# EAGLE design OnboardGlov2 (EAGLE 5.11)
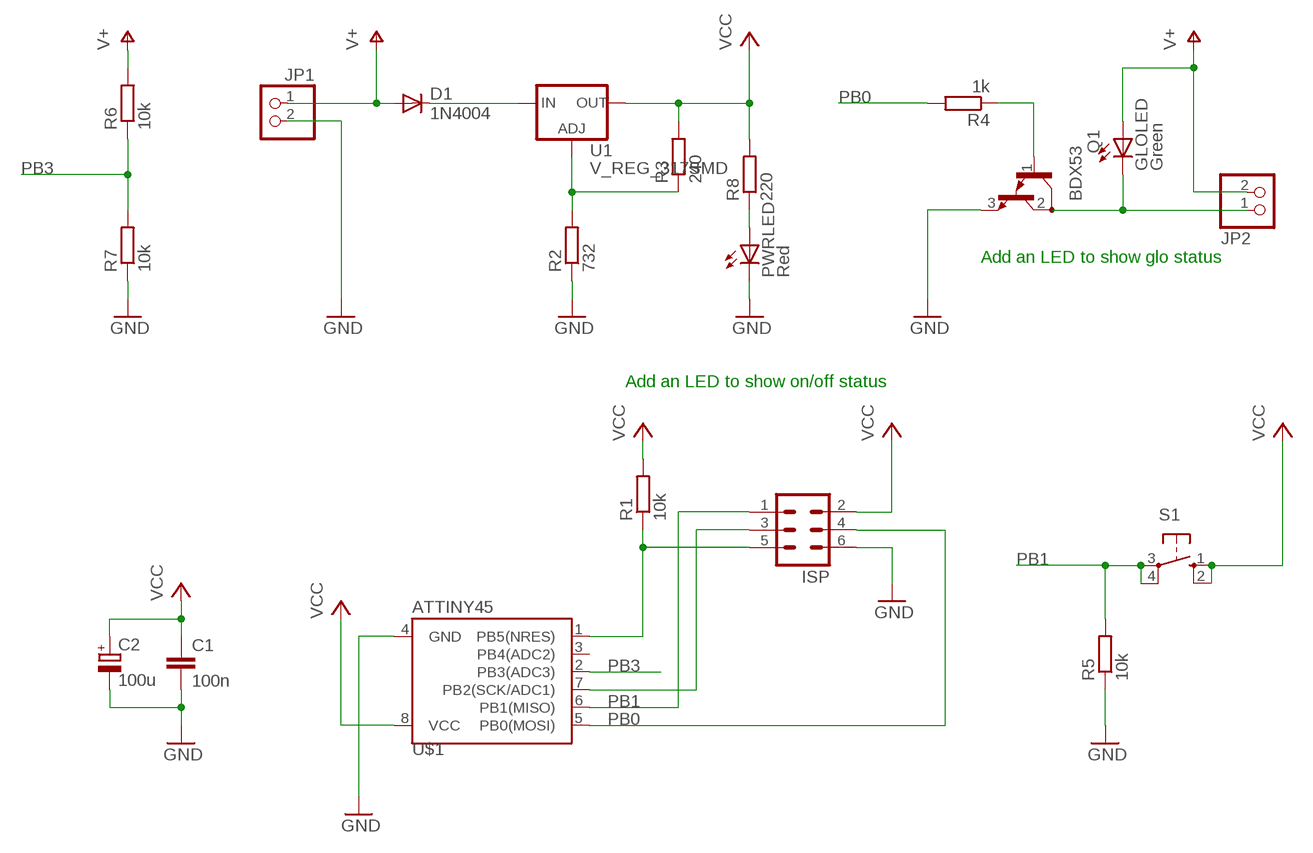
[diagram p0: schematic, sheet 1]

## Parts
C1  100n  C-EUC0805  [C0805]
C2  100u  CPOL-EUB  [PANASONIC_B]
D1  1N4004  [DO41-10]
GLOLED  Green  LEDCHIPLED_1206  [CHIPLED_1206]
ISP  MA03-2  [MA03-2]
JP1  PINHD-1X2/90  [1X02/90]
JP2  PINHD-1X2/90  [1X02/90]
PWRLED  Red  LEDCHIPLED_1206  [CHIPLED_1206]
Q1  BDX53  [TO220]
R1  10k  R-EU_R0805  [R0805]
R2  732  R-EU_R0805  [R0805]
R3  240  R-EU_R0805  [R0805]
R4  1k  R-EU_R0805  [R0805]
R5  10k  R-EU_R0805  [R0805]
R6  10k  R-EU_R0805  [R0805]
R7  10k  R-EU_R0805  [R0805]
R8  220  R-EU_R0805  [R0805]
S1  10-XX  [B3F-10XX]
U1  V_REG_317SMD  [SOT223]
U$1  ATTINY45  [SO08-EIAJ]

## Nets
GND: C1.2 C2.- ISP.6 JP1.2 PWRLED.C Q1.3(E) R2.1 R5.1 R7.1 U$1.4(GND)
N$1: GLOLED.C JP2.1 Q1.2(C)
N$2: R2.2 R3.1 U1.1(ADJ)
N$3: PWRLED.A R8.1
N$4: ISP.5 R1.1 U$1.1(PB5(NRES))
N$5: ISP.3 U$1.7(PB2(SCK/ADC1))
N$7: D1.C U1.3(IN)
N$11: Q1.1(B) R4.1
PB0: ISP.4 R4.2 U$1.5(PB0(MOSI))
PB1: ISP.1 R5.2 S1.3(P) S1.4(P1) U$1.6(PB1(MISO))
PB3: R6.1 R7.2 U$1.2(PB3(ADC3))
V+: D1.A GLOLED.A JP1.1 JP2.2 R6.2
VCC: C1.1 C2.+ ISP.2 R1.2 R3.2 R8.2 S1.1(S) S1.2(S1) U1.2(OUT) U$1.8(VCC)
Unconnected: U$1.3(PB4(ADC2))

## Notes on the sheet
- Add an LED to show glo status
- Add an LED to show on/off status

## Library data of the parts
C1 = rcl:C-EU: CAPACITOR, European symbol
C2 = rcl:CPOL-EU: POLARIZED CAPACITOR, European symbol
D1 = diode:1N4004: DIODE general purpose rectifier, 1 A
GLOLED PWRLED = led:LED: LED OSRAM: - CHIPLED LG R971, LG N971, LY N971, LG Q971, LY Q971, LO R971, LY R971 LH N974, LH R974 LS Q976, LO Q976, LY Q976 LO Q996 - Hyper CHIPLED LW Q18S LB Q993, LB Q99A, LB R99A - SideLED LS A670, LO A670, LY A670, LG A670, LP A670 LB A673, LV A673, LT A673, LW A673 LH A674 LY A675 LS A676, LA A676, LO A676, LY A676, LW A676 LS A679, LY A679, LG A679 - Hyper Micro SIDELED® LS Y876, LA Y876, LO Y876, LY Y876 LT Y87S - SmartLED LW L88C, LW L88S LB L89C, LB L89S, LG L890 LS L89K, LO L89K, LY L89K LS L896, LA L896, LO L896, LY L896 - TOPLED LS T670, LO T670, LY T670, LG T670, LP T670 LSG T670, LSP T670, LSY T670, LOP T670, LYG T670 LG T671, LOG T671, LSG T671 LB T673, LV T673, LT T673, LW T673 LH T674 LS T676, LA T676, LO T676, LY T676, LB T676, LH T676, LSB T676, LW T676 LB T67C, LV T67C, LT T67C, LS T67K, LO T67K, LY T67K, LW E67C LS E67B, LA E67B, LO E67B, LY E67B, LB E67C, LV E67C, LT E67C LW T67C LS T679, LY T679, LG T679 LS T770, LO T770, LY T770, LG T770, LP T770 LB T773, LV T773, LT T773, LW T773 LH T774 LS E675, LA E675, LY E675, LS T675 LS T776, LA T776, LO T776, LY T776, LB T776 LHGB T686 LT T68C, LB T68C - Hyper Mini TOPLED® LB M676 - Mini TOPLED Santana® LG M470 LS M47K, LO M47K, LY M47K Source: http://www.osram.convergy.de LUXEON: - LUMILED® LXK2-PW12-R00, LXK2-PW12-S00, LXK2-PW14-U00, LXK2-PW14-V00 LXK2-PM12-R00, LXK2-PM12-S00, LXK2-PM14-U00 LXK2-PE12-Q00, LXK2-PE12-R00, LXK2-PE12-S00, LXK2-PE14-T00, LXK2-PE14-U00 LXK2-PB12-K00, LXK2-PB12-L00, LXK2-PB12-M00, LXK2-PB14-N00, LXK2-PB14-P00, LXK2-PB14-Q00 LXK2-PR12-L00, LXK2-PR12-M00, LXK2-PR14-Q00, LXK2-PR14-R00 LXK2-PD12-Q00, LXK2-PD12-R00, LXK2-PD12-S00 LXK2-PH12-R00, LXK2-PH12-S00 LXK2-PL12-P00, LXK2-PL12-Q00, LXK2-PL12-R00 Source: www.luxeon.com KINGBRIGHT: KA-3528ASYC Source: www.kingbright.com
ISP = con-lstb:MA03-2: PIN HEADER
JP1 JP2 = pinhead:PINHD-1X2: PIN HEADER
Q1 = transistor-npn:BDX53*: NPN Darlington Transistor
R1-R8 = rcl:R-EU_: RESISTOR, European symbol
S1 = switch-omron:10-XX: OMRON SWITCH; MPN: B3F-1000; OC_FARNELL: 176432; OC_NEWARK: 36M3542
U1 = SparkFun:V_REG_317: Voltage Regulator Standard LM317 adjustable voltage regulator. AOI (Adjust Output Input). Google 'LM317 Calculator' for easy to use app to get the two resistor values needed. 240/720 for 5V output. 240/390 for 3.3V output. Spark Fun Electronics SKU : COM-00527
U$1 = SparkFun:ATTINY45: Atmel ATTiny45

## Board
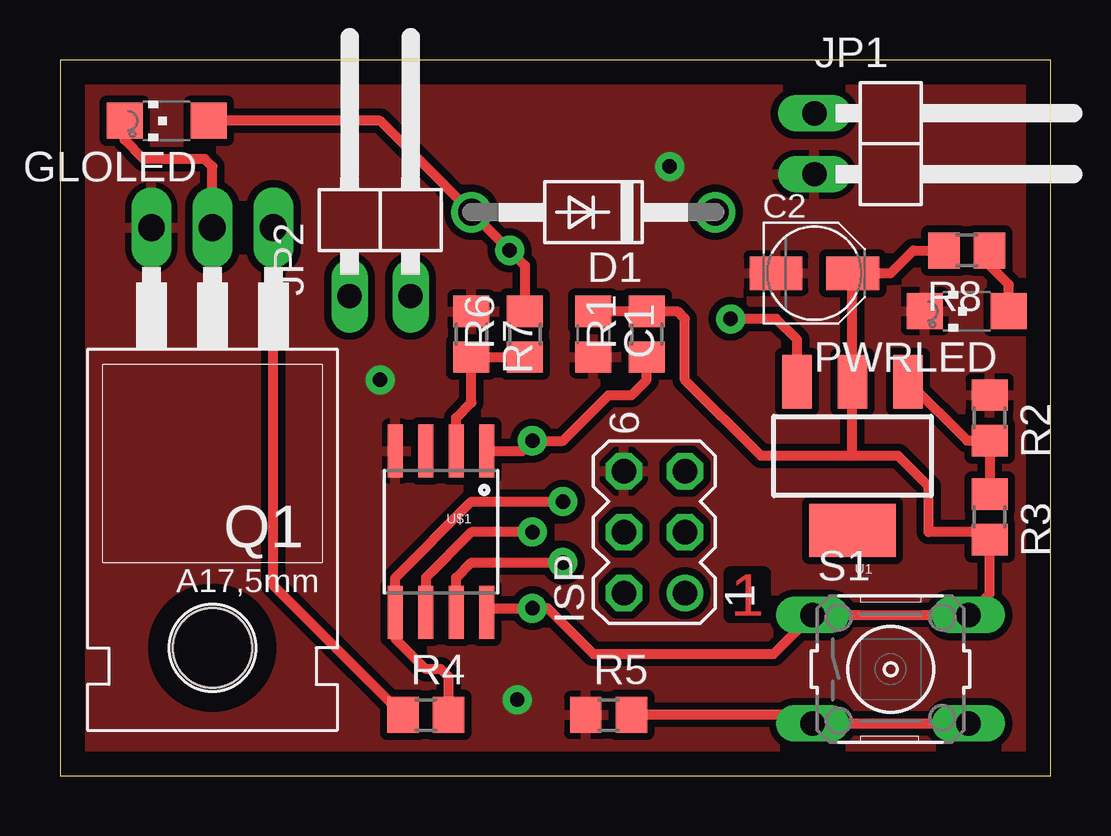
[diagram p1: board, top side]
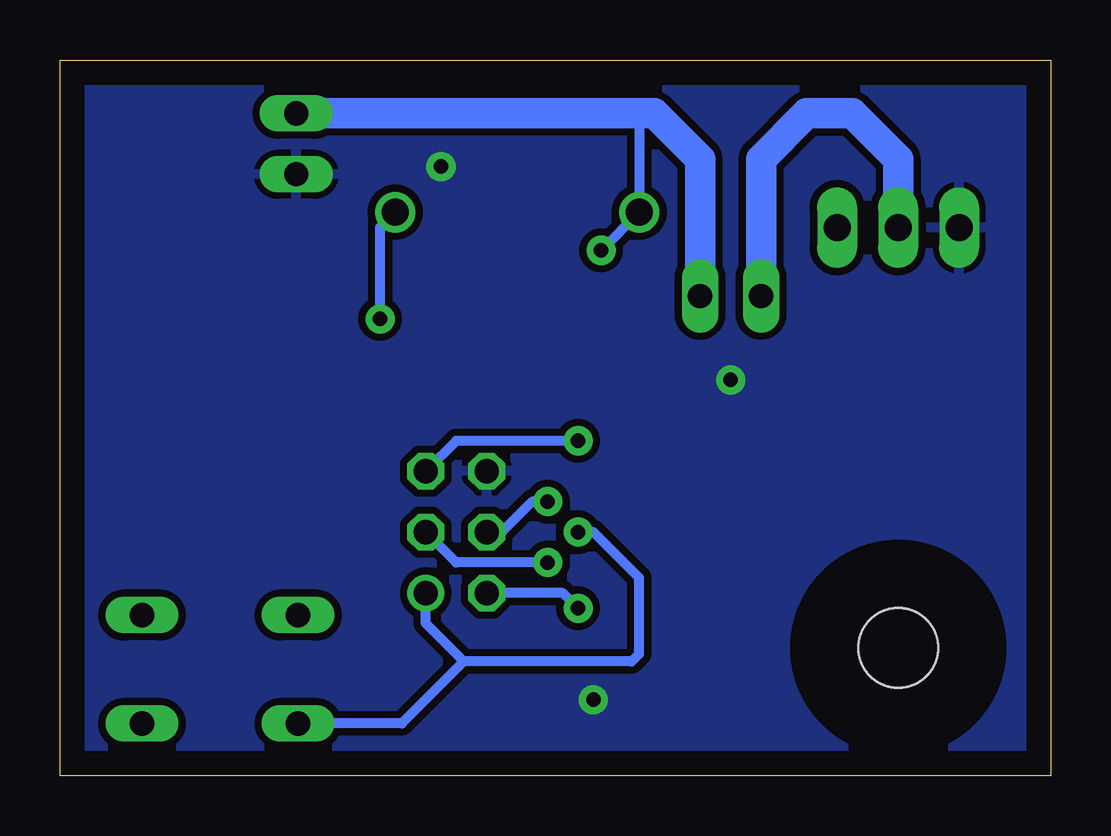
[diagram p2: board, bottom side, seen from below]

Size 41.27 x 29.84 mm. Coordinates in mm from the lower left corner, seen from the top.
Outline: 0,0 41.27,0 41.27,29.84 0,29.84 0,0
Copper layers (1*16): Top 0.035mm / dielectric 1.5mm / Bottom 0.035mm
Design rules "default *": minimum track width 10mil, minimum drill 0.6mm, track to track 8mil, track to pad 8mil, pad to pad 8mil, via to via 8mil, smd to smd 8mil, copper to edge 40mil, drill to drill 8mil, minimum pad ring 10mil, minimum via ring 12mil, stop-mask expansion 4mil, vias tented up to drill 0mil, thermal gap 10mil

### Footprints (pad centres in the part's own frame; a part is rotated, then mirrored left to right if it is on the bottom)
C0805 = smd 1.3 x 1.5: 1 -0.95,0; 2 0.95,0
PANASONIC_B = smd 2.2 x 1.4: + 1.6,0; - -1.6,0
DO41-10 = drill 1.118 round: A 5.08,0; C -5.08,0
CHIPLED_1206 = smd 1.5 x 1.5: A 0,-1.75; C 0,1.75
MA03-2 = drill 1.016 round: 1 -2.54,-1.27 | drill 1.016 octagon: 2 -2.54,1.27; 3 0,-1.27; 4 0,1.27; 5 2.54,-1.27; 6 2.54,1.27
1X02/90 = drill 1.016 long: 1 -1.27,-3.81; 2 1.27,-3.81
TO220 = drill 1.118 long: 1 -2.54,-6.35; 2 0,-6.35; 3 2.54,-6.35 | hole 3.302: 0,11.176
R0805 = smd 1.3 x 1.5: 1 -0.95,0; 2 0.95,0
B3F-10XX = drill 1.016 long: 1 -3.251,2.261; 2 3.251,2.261; 3 -3.251,-2.261; 4 3.251,-2.261
SOT223 = smd 1.219 x 2.235: 1 -2.311,-3.099; 2 0,-3.099; 3 2.311,-3.099 | smd 3.6 x 2.2: 4 0,3.099
SO08-EIAJ = smd 0.61 x 2.21: 1 -1.905,-3.378; 2 -0.635,-3.378; 3 0.635,-3.378; 4 1.905,-3.378; 5 1.905,3.353; 6 0.635,3.353; 7 -0.635,3.353; 8 -1.905,3.353

### Placement (x,y rotation side)
C1  22.23,18.41 270 top
C2  31.43,20.95 0 top
D1  22.23,23.5 180 top
GLOLED  4.45,27.3 90 top
ISP  24.77,10.16 90 top
JP1  35.24,26.35 270 top
JP2  13.34,23.81 0 top
PWRLED  37.78,19.37 90 top
Q1  6.35,16.51 180 top
R1  24.45,18.41 90 top
R2  38.73,14.92 270 top
R3  38.73,10.79 270 top
R4  15.24,2.54 0 top
R5  22.86,2.54 0 top
R6  19.37,18.41 90 top
R7  17.14,18.41 270 top
R8  37.78,21.91 180 top
S1  34.61,4.45 0 top
U1  33.02,13.34 180 top
U$1  15.88,10.16 180 top

### Tracks (layer width: path | path; a pad name or v marks a point on that pad's centre or on a via)
GND  (via drill 0.6)
  other vias: 19.05,3.17 25.4,25.4 13.34,16.51
  pour Top (isolate 0.305): 41.27,29.84 0,29.84 0,0 41.27,0
  pour Bottom (isolate 0.305): 41.27,29.84 0,29.84 0,0 41.27,0
N$1
  Top 0.406: Q1.2 6.35,25.4 6.03,25.72 3.49,25.72 2.69,26.52 GLOLED.C
  Bottom 1.27: Q1.2 6.35,25.72 8.26,27.62 10.16,27.62 12.06,25.72 JP2.1
N$2
  Top 0.406: R3.1 R2.2 37.79,13.97 U1.1
N$3
  Top 0.406: PWRLED.A 39.53,20.48 38.73,21.27 R8.1
N$4  (via drill 0.6)
  Top 0.406: U$1.1 19.25,13.54 v19.68,13.97 20.95,13.97 22.86,15.88 23.81,15.88 24.45,16.51 R1.1
  Bottom 0.406: v19.68,13.97 24.77,13.97 ISP.5
N$5  (via drill 0.6)
  Top 0.406: v20.95,8.89 17.14,8.89 16.51,8.26 U$1.7
  Bottom 0.406: ISP.3 24.77,8.89 v20.95,8.89
N$7  (via drill 0.6)
  Top 0.406: v27.94,19.05 29.84,19.05 30.71,18.19 U1.3
  Bottom 0.406: D1.C 27.94,22.86 v27.94,19.05
N$11
  Top 0.406: R4.1 8.89,7.94 Q1.1
PB0  (via drill 0.6)
  Top 0.406: v20.95,11.43 17.14,11.43 13.97,8.26 U$1.5 13.97,5.71 15.24,4.45 15.88,4.45 16.19,4.13 R4.2
  Bottom 0.406: ISP.4 22.86,10.16 21.59,11.43 v20.95,11.43
PB1  (via drill 0.6)
  Top 0.406: v19.68,10.16 17.14,10.16 15.24,8.26 U$1.6 | S1.4 S1.3 31,2.54 R5.2
  Bottom 0.406: 24.45,4.76 17.46,4.76 17.14,5.08 17.14,8.26 19.05,10.16 v19.68,10.16 | 24.45,4.76 26.04,6.35 ISP.1 | 24.45,4.76 27.03,2.18 S1.3
PB3
  Top 0.406: R6.1 R7.2 17.14,15.56 16.51,14.92 U$1.2
V+  (via drill 0.6)
  Top 0.406: R6.2 19.37,21.27 v18.73,21.91 13.34,27.3 GLOLED.A
  Bottom 0.406: 17.14,27.62 D1.A v18.73,21.91
  Bottom 1.27: JP2.2 14.61,25.72 16.51,27.62 17.14,27.62 JP1.1
VCC  (via drill 0.6)
  Top 0.406: U$1.8 17.96,6.99 v19.68,6.99 20.32,6.99 22.23,5.08 29.73,5.08 S1.1 S1.2 38.73,7.58 R3.2 38.42,10.16 36.2,10.16 36.2,12.06 34.92,13.34 33.02,13.34 | 33.02,13.34 U1.2 C2.+ 34.61,20.95 35.56,21.91 R8.2 | 33.02,13.34 29.21,13.34 26.04,16.51 26.04,19.05 25.72,19.37 25.71,19.36 R1.2 C1.1
  Bottom 0.406: v19.68,6.99 20.32,7.62 ISP.2

### Text on the board
Top: 1